# EAGLE design ECG_V4 (EAGLE 7.6.0)
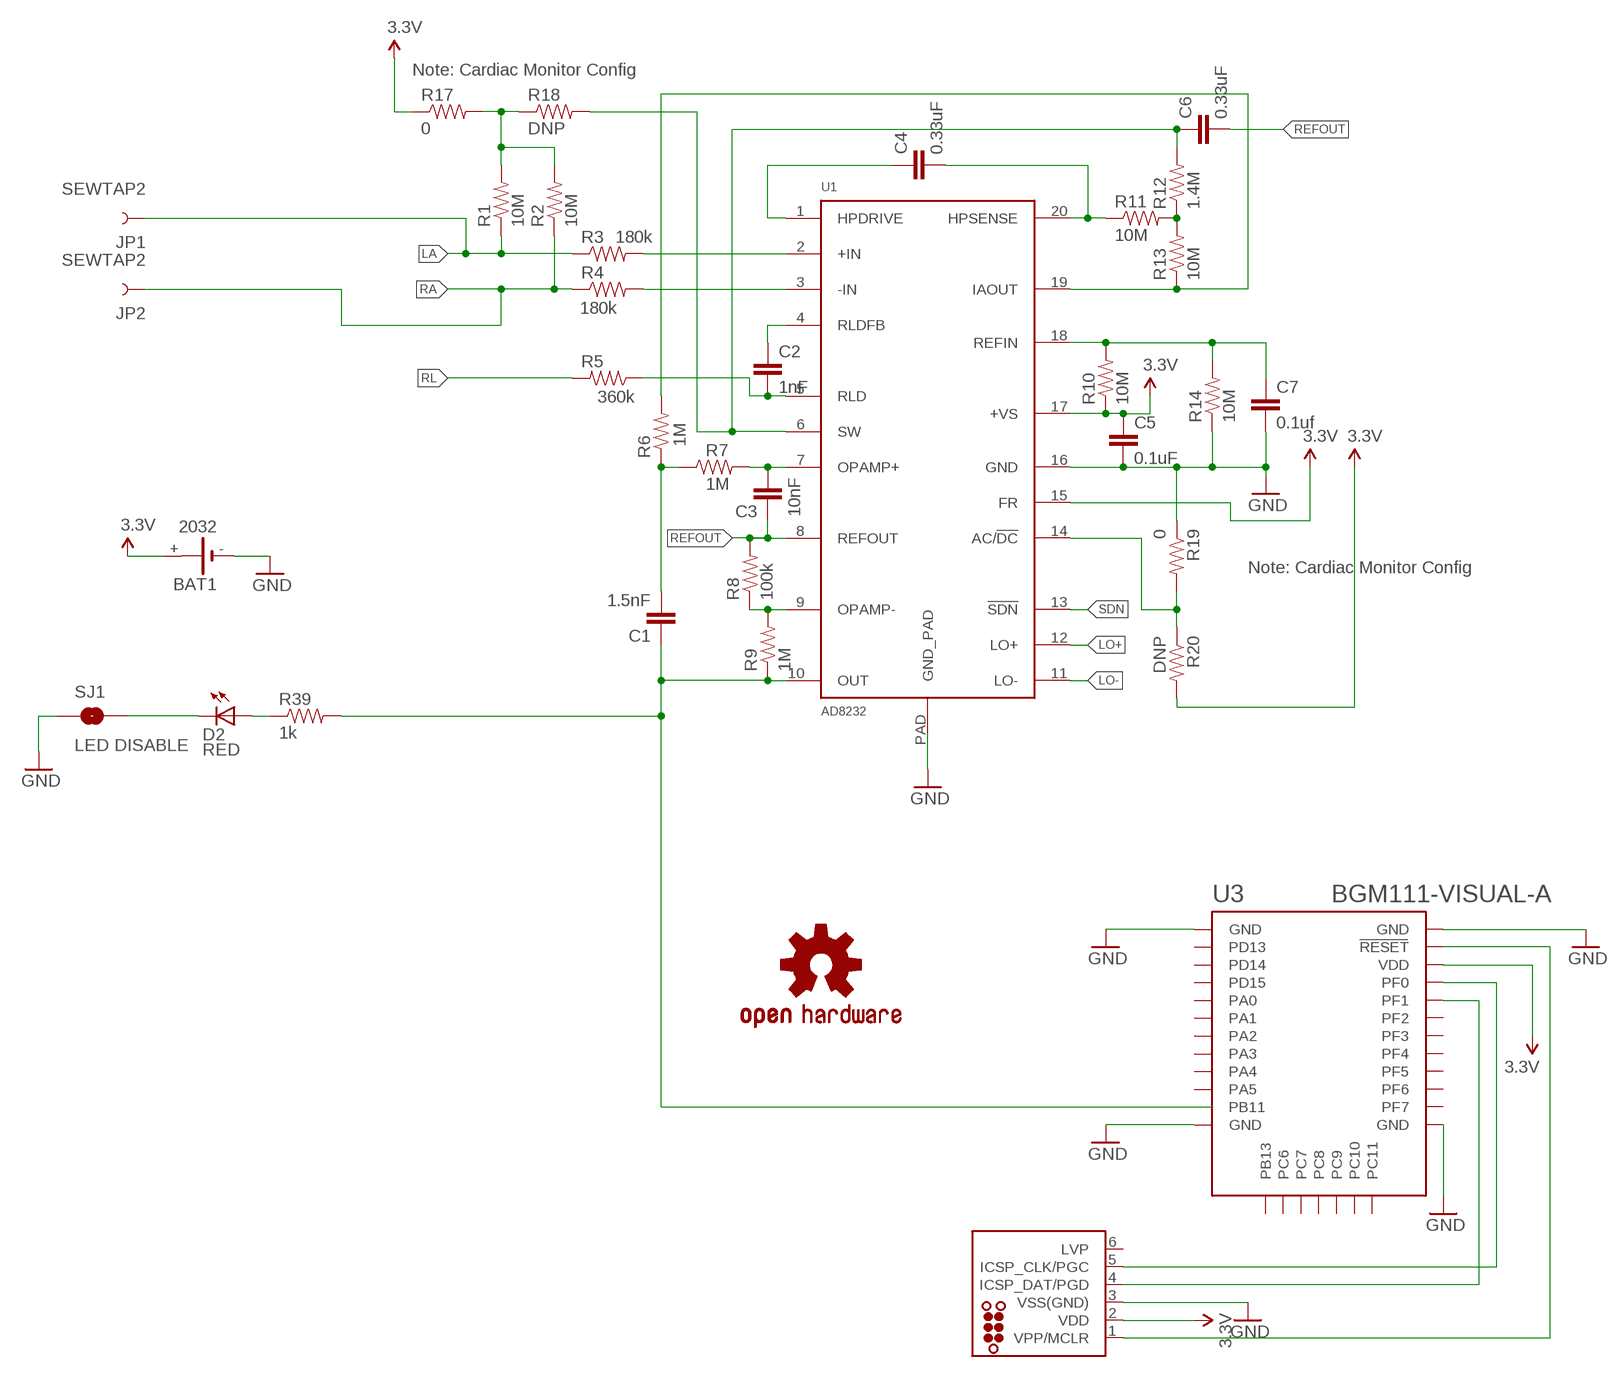
[diagram p0: schematic, sheet 1]

## Parts
BAT1  2032  [KZH20SMD]
C1  1.5nF  CAP0603-CAP  [0603-CAP]
C2  1nF  CAP0603-CAP  [0603-CAP]
C3  10nF  CAP0603-CAP  [0603-CAP]
C4  0.33uF  CAP0805  [0805]
C5  0.1uF  CAP0603-CAP  [0603-CAP]
C6  0.33uF  CAP0805  [0805]
C7  0.1uf  CAP0603-CAP  [0603-CAP]
D2  RED  LED-RED0603  [LED-0603]
J2  TC2030-MCP-NL  [TC2030-MCP-NL]
JP1  SEWTAP2  [PETAL-LONG-2]
JP2  SEWTAP2  [PETAL-LONG-2]
LOGO1  OSHW-LOGOS  [OSHW-LOGO-S]
R1  10M  RESISTOR0603-RES  [0603-RES]
R2  10M  RESISTOR0603-RES  [0603-RES]
R3  180k  RESISTOR0603-RES  [0603-RES]
R4  180k  RESISTOR0603-RES  [0603-RES]
R5  360k  RESISTOR0603-RES  [0603-RES]
R6  1M  RESISTOR0603-RES  [0603-RES]
R7  1M  RESISTOR0603-RES  [0603-RES]
R8  100k  RESISTOR0603-RES  [0603-RES]
R9  1M  RESISTOR0603-RES  [0603-RES]
R10  10M  RESISTOR0603-RES  [0603-RES]
R11  10M  RESISTOR0603-RES  [0603-RES]
R12  1.4M  RESISTOR0603-RES  [0603-RES]
R13  10M  RESISTOR0603-RES  [0603-RES]
R14  10M  RESISTOR0603-RES  [0603-RES]
R17  0  0OHM1/10W5%(0603)  [0603]
R18  DNP  0OHM1/10W5%(0603)  [0603]
R19  0  0OHM1/10W5%(0603)  [0603]
R20  DNP  0OHM1/10W5%(0603)  [0603]
R39  1k  1K-1%  [0603-RES]
SJ1  LED DISABLE  SOLDERJUMPERTRACE  [SJ_2S-TRACE]
U1  AD8232  [LFCSP_20]
U3  BGM111-VISUAL-A  [BGM111-A]

## Nets
3.3V: BAT1.+ C5.1 J2.2(VDD) R10.1 R17.1 R20.2 U1.15(FR) U1.17(+VS) U3.VDD
GND: BAT1.- C5.2 C7.2 J2.3(VSS(GND)) R14.1 R19.1 SJ1.1 U1.16(GND) U1.PAD(GND_PAD) U3.GND U3.GND@2(GND) U3.GND@3(GND) U3.GND@4(GND)
LA: JP1.1 R1.1 R3.1
LO+: U1.12(LO+)
LO-: U1.11(LO-)
N$1: R3.2 U1.2(+IN)
N$2: R4.2 U1.3(-IN)
N$3: C3.2 R7.2 U1.7(OPAMP+)
N$4: C4.2 R11.1 U1.20(HPSENSE)
N$5: C7.1 R10.2 R14.2 U1.18(REFIN)
N$7: R8.1 R9.2 U1.9(OPAMP-)
N$8: R6.2 R13.1 U1.19(IAOUT)
N$9: C1.2 R6.1 R7.1
N$11: R19.2 R20.1 U1.14(AC/!DC)
N$13: C4.1 U1.1(HPDRIVE)
N$14: R11.2 R12.1 R13.2
N$16: C6.1 R12.2 R18.2 U1.6(SW)
N$17: C2.1 U1.4(RLDFB)
N$18: C2.2 R5.1 U1.5(RLD)
N$20: R1.2 R2.2 R17.2 R18.1
N$29: J2.1(VPP/MCLR) U3.RESET
N$31: J2.5(ICSP_CLK/PGC) U3.PF0
N$33: J2.4(ICSP_DAT/PGD) U3.PF1
N$36: D2.A R39.1
N$37: D2.C SJ1.2
RA: JP2.1 R2.1 R4.1
REFOUT: C3.1 C6.2 R8.2 U1.8(REFOUT)
RL: R5.2
SDN: U1.13(!SDN)
SIGNAL_OUT: C1.1 R9.1 R39.2 U1.10(OUT)
Unconnected: J2.6(LVP) U3.PA0 U3.PA1 U3.PA2 U3.PA3 U3.PA4 U3.PA5 U3.PB11 U3.PB13 U3.PC6 U3.PC7 U3.PC8 U3.PC9 U3.PC10 U3.PC11 U3.PD13 U3.PD14 U3.PD15 U3.PF2 U3.PF3 U3.PF4 U3.PF5 U3.PF6 U3.PF7

## Notes on the sheet
- Note: Cardiac Monitor Config
- Note: Cardiac Monitor Config

## Library data of the parts
BAT1 = SMTU-2032-1:2032
C1-C7 = SparkFun-Passives:CAP: Capacitor Standard 0603 ceramic capacitor, and 0.1" leaded capacitor.
D2 = SparkFun-LED:LED-RED: Assorted Red LEDs LilyPad 1206- DIO-09912 1206- DIO-00809 0603- DIO-00819; PROD_ID: DIO-00819
J2 = tag-connect:TC2030: TAG-CONNECT ICSP Connector Manufacturer: Tag-Connect <http://www.tag-connect.com> Cable for easy In-Circuit Serial Programming. Designed for Microchip ICD2, suitable for many others. Two variants - one "with legs" (for hands-free fit on PCB) and another "without legs" for quick programming. PAD Description 1 MCLR/Vpp 2 Vdd 3 GND 4 PGD (ISPDAT) 5 PGC (ISPCLK) 6 nc (used for LVP) ©2009 ROFA.cz - modified and updated by Robert Darlington ‹rdarlington@gmail.com›
JP1 JP2 = LilyPad-Wearables:SEWTAP: Sew Taps for LilyPad Boards.
LOGO1 = SparkFun-Aesthetics:OSHW-LOGO: Open Source Hardware Logo This logo indicates the piece of hardware it is found on incorporates a OSHW license and/or adheres to the definition of open source hardware found here: http://freedomdefined.org/OSHW
R1-R14 = SparkFun-Passives:RESISTOR: Resistor Basic schematic elements and footprints for 0603, 1206, and PTH resistors.
R17 R19 = SparkFun-Resistors:0OHM1/10W5%(0603): RES-08609; PROD_ID: RES-08609
R18 R20 = SparkFun-Resistors:0OHM1/10W5%(0603): RES-08609; PROD_ID: RES-08609; VALUE: 0
R39 = SparkFun-Resistors:1K-1%: 1k-ohm SMT 1/10W - 1% (0603) RES-07856; PROD_ID: RES-07856
SJ1 = SparkFun-Passives:SOLDERJUMPER: Solder Jumper Standard SMD solder jumper. Used to automate production. Two varients : Normally Open and Normally Closed are the same, but have different paste layers. NC will have a large amount of paste and should jumper during reflow.
U1 = AD8232:AD8232
U3 = sf-bluegiga:BGM111-VISUAL: Bluetooth 4.1 (4.2 ready) low-energy module (Bluetooth Smart) - BGM111-A variant has an on-module ceramic chip antenna. BGM111-A variant includes keepout/restrict area. Antenna edge of the module should be flush up against the edge of the PCB. See datasheet for variant layout details. IT IS EXTREMELY IMPORTANT THAT YOU FOLLOW THE LAYOUT GUIDELINES FOR THIS MODULE IN ORDER TO ENSURE MAXIMUM RANGE. THIS MEANS THAT YOU NEED A SOLID GROUND PLANE EXTENDING IDEALLY 17 mm ON THE LEFT AND RIGHT SIDES OF THE MODULE, AS SHOWN IN THE DATASHEET. The Silicon Labs Blue Gecko BGM111 Bluetooth® Smart module integrates our next generation wireless SoC with a complete Bluetooth Smart software stack and antenna to provide a complete, pre-certified plug-and-play Bluetooth Smart solution. It solves one of the major customer roadblocks for fast time-to-market as it integrates antenna, software and RF certifications, saving months of engineering effort and testing. https://www.silabs.com/products/wireless/bluetooth/Pages/BGM111-bluetooth-smart-module.aspx https://github.com/jrowberg/sf-oshw Last updated 2015-09-02 by Jeff Rowberg <jeff@rowberg.net>; ANTENNA: On-module ceramic chip antenna

## Board
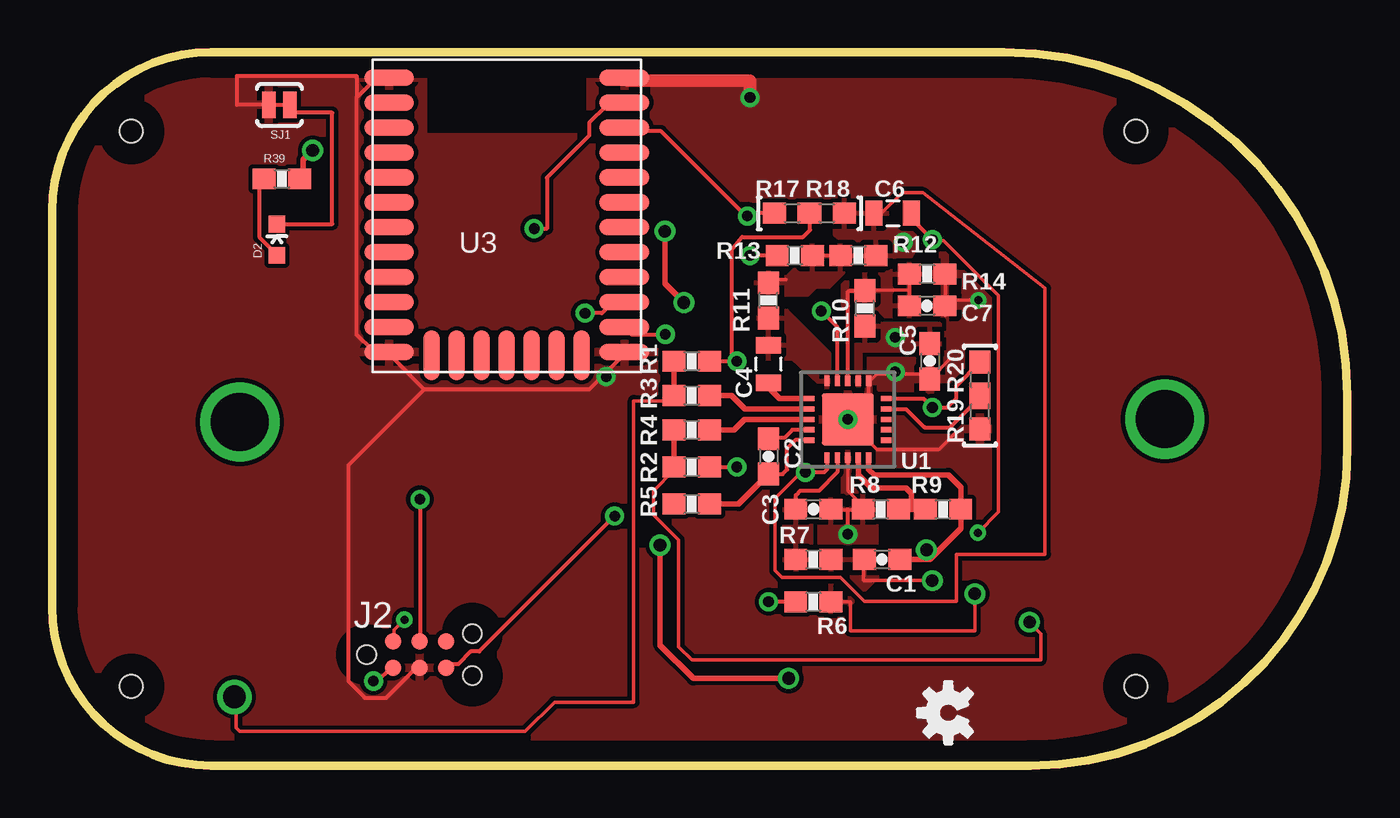
[diagram p1: board, top side]
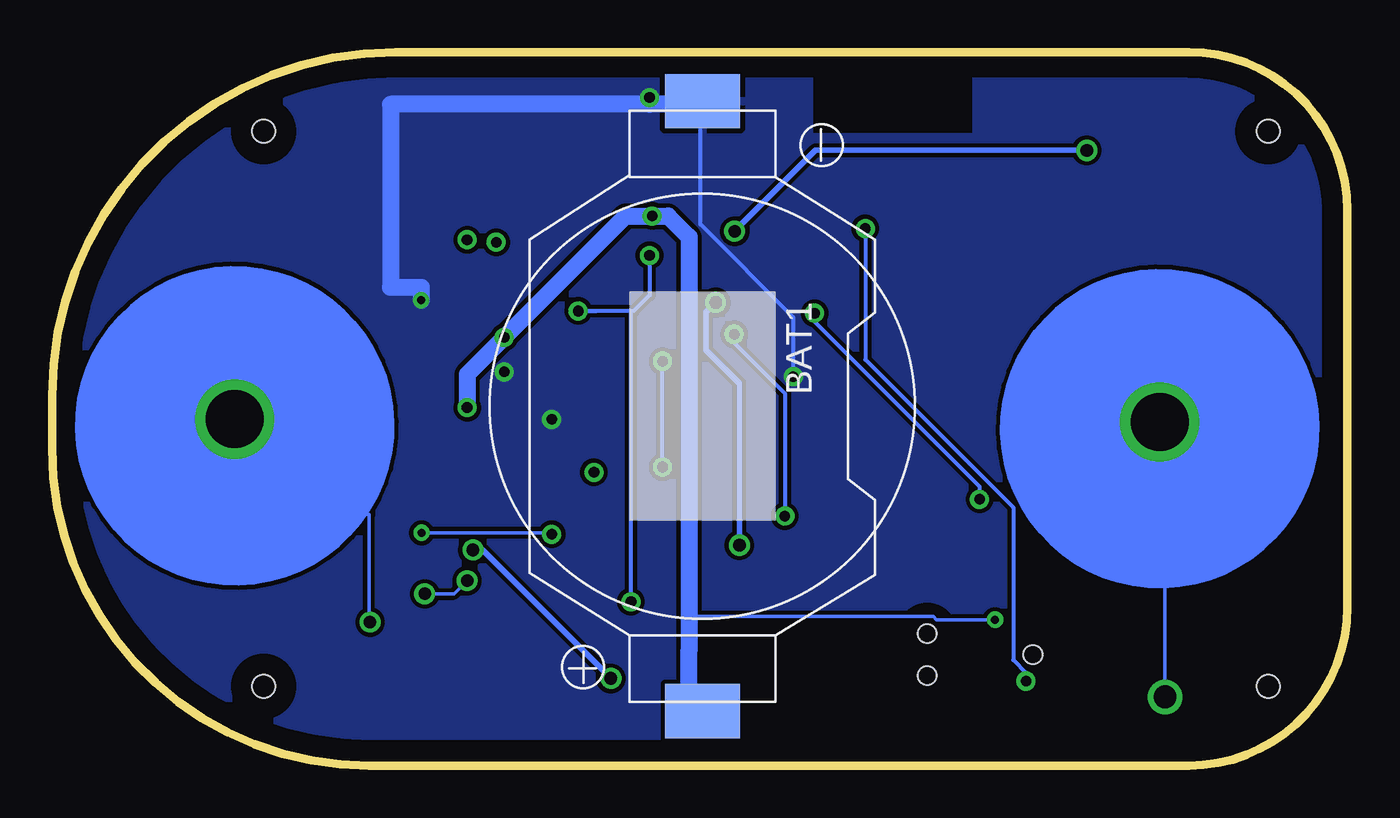
[diagram p2: board, bottom side, seen from below]

Size 62.23 x 34.29 mm. Coordinates in mm from the lower left corner, seen from the top.
Outline: 7.62,34.29 45.72,34.29 arc-90 62.23,17.78 62.23,15.24 arc-90 46.99,0 7.62,0 arc-90 0,7.62 0,26.67 arc-90 7.62,34.29
Copper layers (1*16): Top 0.035mm / dielectric 1.5mm / Bottom 0.035mm
Design rules "default": minimum track width 10mil, minimum drill 24mil, track to track 8mil, track to pad 8mil, pad to pad 8mil, via to via 8mil, smd to smd 8mil, copper to edge 40mil, drill to drill 8mil, minimum pad ring 10mil, minimum via ring 8mil, stop-mask expansion 4mil, vias tented up to drill 0mil, thermal gap 10mil
Holes 1.1 mm at 3.81,3.81 3.81,30.48 52.07,30.48 52.07,3.81

### Footprints (pad centres in the part's own frame; a part is rotated, then mirrored left to right if it is on the bottom)
KZH20SMD = smd 2.6 x 3.6: + 14.65,0; - -14.65,0
0603-CAP = smd 1.1 x 1: 1 -0.85,0; 2 0.85,0
0805 = smd 0.8 x 1.2: 1 -0.9,0; 2 0.9,0
LED-0603 = smd 0.8 x 0.8: A 0,-0.75; C 0,0.75
TC2030-MCP-NL = smd 0.787 x 0.787: 1 1.27,-0.635; 2 1.27,0.635; 3 2.54,-0.635; 4 2.54,0.635; 5 3.81,-0.635; 6 3.81,0.635 | hole 0.889: 0,0; 5.08,-1.016; 5.08,1.016
PETAL-LONG-2 = drill 2.794: 1 0,0
0603-RES = smd 1.1 x 1: 1 -0.85,0; 2 0.85,0
0603 = smd 1.1 x 1: 1 -0.85,0; 2 0.85,0
SJ_2S-TRACE = smd 0.635 x 1.27: 1 -0.508,0; 2 0.508,0
LFCSP_20 = smd 0.5 x 0.25: 1 -1.85,1; 2 -1.85,0.5; 3 -1.85,0; 4 -1.85,-0.5; 5 -1.85,-1; 11 1.85,-1; 12 1.85,-0.5; 13 1.85,0; 14 1.85,0.5; 15 1.85,1 | smd 0.25 x 0.5: 6 -1,-1.85; 7 -0.5,-1.85; 8 0,-1.85; 9 0.5,-1.85; 10 1,-1.85; 16 1,1.85; 17 0.5,1.85; 18 0,1.85; 19 -0.5,1.85; 20 -1,1.85 | smd 2.5 x 2.5: PAD 0,0
BGM111-A = smd 2.4 x 0.8: GND -5.65,6.65; GND@2 -5.65,-6.55; GND@3 5.65,-6.55; GND@4 5.65,6.65; PA0 -5.65,1.85; PA1 -5.65,0.65; PA2 -5.65,-0.55; PA3 -5.65,-1.75; PA4 -5.65,-2.95; PA5 -5.65,-4.15; PB11 -5.65,-5.35; PD13 -5.65,5.45; PD14 -5.65,4.25; PD15 -5.65,3.05; PF0 5.65,-5.35; PF1 5.65,-4.15; PF2 5.65,-2.95; PF3 5.65,-1.75; PF4 5.65,-0.55; PF5 5.65,0.65; PF6 5.65,1.85; PF7 5.65,3.05; RESET 5.65,5.45; VDD 5.65,4.25 | smd 0.8 x 2.4: PB13 -3.6,-6.7; PC6 -2.4,-6.7; PC7 -1.2,-6.7; PC8 0,-6.7; PC9 1.2,-6.7; PC10 2.4,-6.7; PC11 3.6,-6.7

### Placement (x,y rotation side)
BAT1  30.99,17.27 270 bottom
C1  39.88,9.91 180 top
C2  34.42,14.86 270 top
C3  36.58,12.32 180 top
C4  34.42,19.3 90 top
C5  42.16,19.43 270 top
C6  40.39,26.54 0 top
C7  42.04,22.1 0 top
D2  10.79,25.27 0 top
J2  15.11,5.33 0 top
JP1  9.02,16.51 0 bottom
JP2  53.45,16.65 0 bottom
LOGO1  43.05,2.54 90 top
R1  30.73,19.43 0 top
R2  30.73,14.35 0 top
R3  30.73,17.78 0 top
R4  30.73,16.13 0 top
R5  30.73,12.57 180 top
R6  36.58,7.87 180 top
R7  36.58,9.91 180 top
R8  39.81,12.32 180 top
R9  42.8,12.32 180 top
R10  39.05,21.97 90 top
R11  34.42,22.35 90 top
R12  38.73,24.51 0 top
R13  35.69,24.51 0 top
R14  42.04,23.62 180 top
R17  35.56,26.54 0 top
R18  37.21,26.54 0 top
R19  44.58,17.02 90 top
R20  44.58,18.54 90 top
R39  11.05,28.19 0 top
SJ1  10.92,31.75 0 top
U1  38.23,16.64 0 top
U3  21.84,26.42 0 top

### Tracks (layer width: path | path; a pad name or v marks a point on that pad's centre or on a via)
3.3V  (via drill 0.38, 0.51)
  Top 0.178: 33.35,26.42 v33.4,26.42 | v16.93,7.01 16.43,6.51 16.43,6.02 J2.2
  Top 0.203: U1.15 41.86,17.64 v42.29,17.21 42.99,17.21 43.43,17.65 43.43,18.25 R20.2 | R17.1 33.53,26.54 v33.4,26.42 33.33,26.42 29.26,30.48 27.64,30.48 U3.VDD
  Bottom 0.178: 31.37,5.28 31.62,5.59 | v16.93,7.01 19.74,7.01 19.9,7.18 31.62,7.18
  Bottom 0.813: v42.29,17.21 42.29,18.8 v40.51,20.57 34.67,26.42 v33.4,26.42 32.64,26.42 31.62,25.4 31.62,7.18 31.62,5.59 31.62,2.03 30.99,2.67 | BAT1.+ 30.99,2.67 | 30.99,2.67 30.61,3.05
  pour Top (isolate 0.203): 38.61,18.29 38.86,18.29 38.86,19.94 42.67,19.94 42.67,21.21 38.61,21.21
GND  (via drill 0.38, 0.51)
  Top 0.178: C7.2 42.93,22.12 42.93,23.61 R14.1 | U1.16 39.29,18.49 39.62,18.82 40.45,18.82 v40.51,18.92 40.62,18.82 41.94,18.82 42.1,18.66 C5.2 42.27,18.66 43.09,19.48 | 43.42,16.02 42.6,15.19 39.62,15.19 38.3,16.51 U1.PAD | 44.58,16.02 R19.1 | 42.93,21.63 42.93,21.96 C7.2 | v44.5,22.36 42.85,22.36 C7.2
  Top 0.203: 38.73,17.14 U1.PAD 39.23,17.64 U1.16 | 27.64,32.92 U3.GND@4 | 17.88,18.09 16.26,19.71 U3.GND@2 16.05,19.91 15.44,19.91 14.63,20.73 14.63,32.11 | 17.88,18.09 25.81,18.09 26.42,18.69 | 26.42,18.69 27.43,19.71 U3.GND@3 | 14.63,32.11 15.44,32.92 16.05,32.92 U3.GND | 17.88,18.09 14.22,14.43 14.22,4.06 15.04,3.25 16.05,3.25 17.48,4.67 J2.3 | 26.42,18.69 v26.62,18.69 | SJ1.1 8.89,31.75 8.89,33.15 14.63,33.15 14.63,32.11
  Top 0.61: 27.64,32.92 33.53,32.92 v33.53,32.11
  Bottom 0.178: 31.29,31.77 BAT1.-
  Bottom 0.203: v33.53,32.11 33.53,31.77 | v26.62,18.69 26.62,21.54 31.09,26.01 31.09,31.5 BAT1.-
  Bottom 0.813: 31.29,31.77 33.53,31.77 45.97,31.77 45.97,22.99 44.5,22.99 v44.5,22.36
  other vias: 38.23,16.64
  pour Bottom (rank 6): -1.27,35.56 63.5,35.56 63.5,-1.27 -1.27,-1.27
  pour Top (rank 6): -1.27,35.56 63.5,35.56 63.5,-1.27 -1.27,-1.27
LA  (via drill 1.1)
  Top 0.178: 29.81,17.74 R3.1 29.88,17.53 27.94,17.53 27.94,3.05 24.13,3.05 22.73,1.65 9.02,1.65 8.85,1.82 8.85,3.21 arc-90 v8.76,3.3
  Top 0.254: R1.1 R3.1
  Bottom 0.178: v8.76,3.3 8.76,16.26 JP1.1
N$1
  Top 0.254: U1.2 33.28,17.14 32.64,17.78 R3.2
N$2
  Top 0.254: U1.3 33.27,16.64 32.77,16.13 R4.2
N$3
  Top 0.203: U1.7 37.73,14.1 36.83,13.21 35.94,13.21 35.73,12.99 C3.2
  pour Top (isolate 0.203): 35.18,12.83 36.45,12.83 36.45,9.4 35.18,9.4
N$4
  pour Top (isolate 0.203): 37.34,18.16 37.34,19.81 35.31,21.84 33.91,21.84 33.91,19.56 35.56,19.56 37.08,18.16
N$5
  Top 0.178: 41.2,22.86 41.2,23.52 R14.2 | 41.2,22.86 41.2,22.2 C7.1 | 41.2,22.86 39.05,22.86 R10.2
  Top 0.203: U1.18 38.23,22.73 38.32,22.82 R10.2
  pour Top: 38.1,23.24 38.35,23.24 38.73,23.62 40.01,23.62 40.51,24.13 41.91,24.13 41.91,21.59 40.01,21.59 39.75,21.84 39.62,21.84 39.37,22.1 37.97,22.1 37.97,23.11
N$7
  Top 0.254: U1.9 38.73,13.98 39.37,13.33 41.02,13.33 41.27,13.08 41.27,12.32 | R8.1 41.27,12.32 | R9.2 41.27,12.32
N$8  (via drill 0.51)
  Top 0.203: U1.19 37.73,21.07 v36.96,21.84 | R13.1 v33.53,24.51 | R6.2 v34.42,7.87
  Bottom 0.203: 36.07,21.84 v36.96,21.84 34.42,21.84 | 34.42,21.84 34.29,21.84 33.53,22.61 v33.53,24.51 | v34.42,7.87 34.42,21.84
N$9  (via drill 0.6)
  Top 0.178: R6.1 38.35,7.87 38.35,6.48 44.32,6.48 v44.32,8.26 | v42.29,8.89 38.99,8.89 38.99,9.87 C1.2
  Bottom 0.178: v44.32,8.26 42.93,8.26 v42.29,8.89
  pour Top (isolate 0.203): 36.96,10.29 39.88,10.29 39.88,9.27 37.97,7.37 36.96,7.37
N$11
  Top 0.203: U1.14 41.03,17.14 41.91,16.26 43.14,16.26 R20.1 R19.2
N$13
  Top 0.254: U1.1 34.94,17.64 34.42,18.16 C4.1
N$14
  Top 0.178: 37.9,24.51 R12.1 R13.2 36.41,24.51 | 35.26,23.35 34.43,23.35 R11.2
  pour Top: 33.78,23.75 33.78,22.86 34.04,22.61 36.32,22.61 36.7,22.99 37.34,22.99 38.48,24.13 38.48,25.02 36.07,25.02 36.07,24.26 35.31,23.49 34.93,23.49 34.93,23.75
N$16  (via drill 0.51)
  Top 0.178: C6.1 39.85,26.54 40.84,27.53 41.83,27.53 47.7,22.94 47.7,10.16 43.43,10.16 43.43,7.89 39.03,7.89 37.87,9.04 35.07,9.04 34.73,9.37 34.73,12.84 36.05,14.16 v36.2,14.1
  Top 0.203: 39.62,24.51 R12.2 | U1.6 37.23,14.24 37.08,14.1 v36.2,14.1
  other vias: 40.89,25.15
  pour Top (isolate 0.254): 39.12,24.26 41.15,24.26 41.53,24.89 41.53,25.4 41.15,25.78 40.26,25.78 40.13,25.91 40.13,26.92 38.48,26.92 38.23,27.18 37.59,27.18 37.59,25.53
N$17
  Top 0.203: U1.4 35.57,16.14 35.18,15.75 34.42,15.75 C2.1
N$18
  Top 0.203: C2.2 35.09,14.01 35.31,14.22 35.31,15.24 35.7,15.64 U1.5 | R5.1 31.62,12.57
  Top 0.254: C2.2 32.98,12.57 31.62,12.57
N$20  (via drill 0.51)
  Top 0.203: R2.2 v32.89,14.35 | R1.2 v32.89,19.43 32.64,19.68 32.64,24.77 33.15,25.4 36.07,25.4 36.41,25.74 R17.2 R18.1
  Bottom 0.203: v32.89,14.35 v32.89,19.43
N$29  (via drill 0.51)
  Top 0.203: U3.RESET 27.43,31.7 26.62,31.7 25.81,30.89 25.81,30.28 23.77,28.24 23.77,25.81 v23.16,25.81 | v15.44,4.06 15.65,4.06 16.26,4.67 J2.1
  Bottom 0.203: v15.44,4.06 15.44,4.47 16.05,5.08 16.05,12.4 23.16,19.51 v23.16,25.81
N$31  (via drill 0.51)
  Top 0.203: v27.03,11.99 20.52,5.49 20.12,5.49 19.51,4.88 19.1,4.88 J2.5 | v29.46,20.73 27.84,20.73 27.64,20.93 U3.PF0
  Bottom 0.203: v27.03,11.99 27.03,17.88 29.46,20.32 v29.46,20.73
N$33  (via drill 0.51)
  Top 0.203: v17.68,12.8 17.68,6.1 J2.4 | v25.6,21.74 26.42,21.74 26.82,22.15 27.43,22.15 U3.PF1
  Bottom 0.203: v17.68,12.8 17.68,13.41 25.6,21.34 v25.6,21.74
N$36
  Top 0.203: D2.A 10.77,24.59 9.96,25.4 9.96,27.84 10.16,28.04 R39.1
N$37
  Top 0.203: D2.C 13.46,26.02 13.46,31.37 11.43,31.37 SJ1.2
RA  (via drill 0.6)
  Top 0.178: R2.1 29.88,14.2 28.89,13.21 28.89,12.05 30.1,10.85 30.1,5.71 30.73,5.08 47.5,5.08 47.5,6.33 46.89,6.93 v46.95,6.9
  Top 0.254: R4.1 R2.1
  Bottom 0.178: v46.95,6.9 46.99,6.9 46.99,12.06 48.26,12.06 JP2.1
REFOUT  (via drill 0.38, 0.51)
  Top 0.178: U1.8 38.23,13.21 38.96,12.47 R8.2 38.89,12.29 38.23,12.29 37.57,12.29 C3.1 | v44.48,11.19 45.47,12.18 45.47,22.58 42.82,25.22 42.33,25.22 v42.29,25.27
  Top 0.203: C6.2 41.27,26.29 v42.29,25.27 | v38.23,11.11 38.23,12.29 38.23,12.32
  Top 0.254: R8.2 38.99,12.45
  Bottom 0.178: v38.23,11.11 38.23,11.19 v44.48,11.19
  pour Top: 37.97,15.11 38.48,15.11 38.48,13.33 38.86,12.95 39.62,12.95 39.62,10.67 36.83,10.67 36.83,12.83 37.97,12.83
SIGNAL_OUT  (via drill 0.61)
  Top 0.254: U1.10 39.23,14.24 39.5,13.97 43.05,13.97 43.65,13.37 R9.1 43.65,11.39 42.32,10.06 | C1.1 42.16,9.91 42.32,10.06 | v12.52,29.57 12.06,29.11 12.06,28.19 R39.2 | v29.44,25.68 29.44,23.16 v30.35,22.25 | v29.21,10.59 29.21,5.79 30.81,4.19 v35.38,4.19 | 42.32,10.06 v42.01,10.36
  Bottom 0.254: v12.52,29.57 25.55,29.57 v29.44,25.68 | v30.35,22.25 30.81,21.79 30.81,19.96 29.21,18.36 v29.21,10.59 | v35.38,4.19 41.55,10.36 v42.01,10.36